# Altium schematic sheet AduCM3555.SchDoc: ADUCM355
size A4; DrawnBy: Lohith DAYANTRI; SheetNumber: 1; SheetTotal: 1
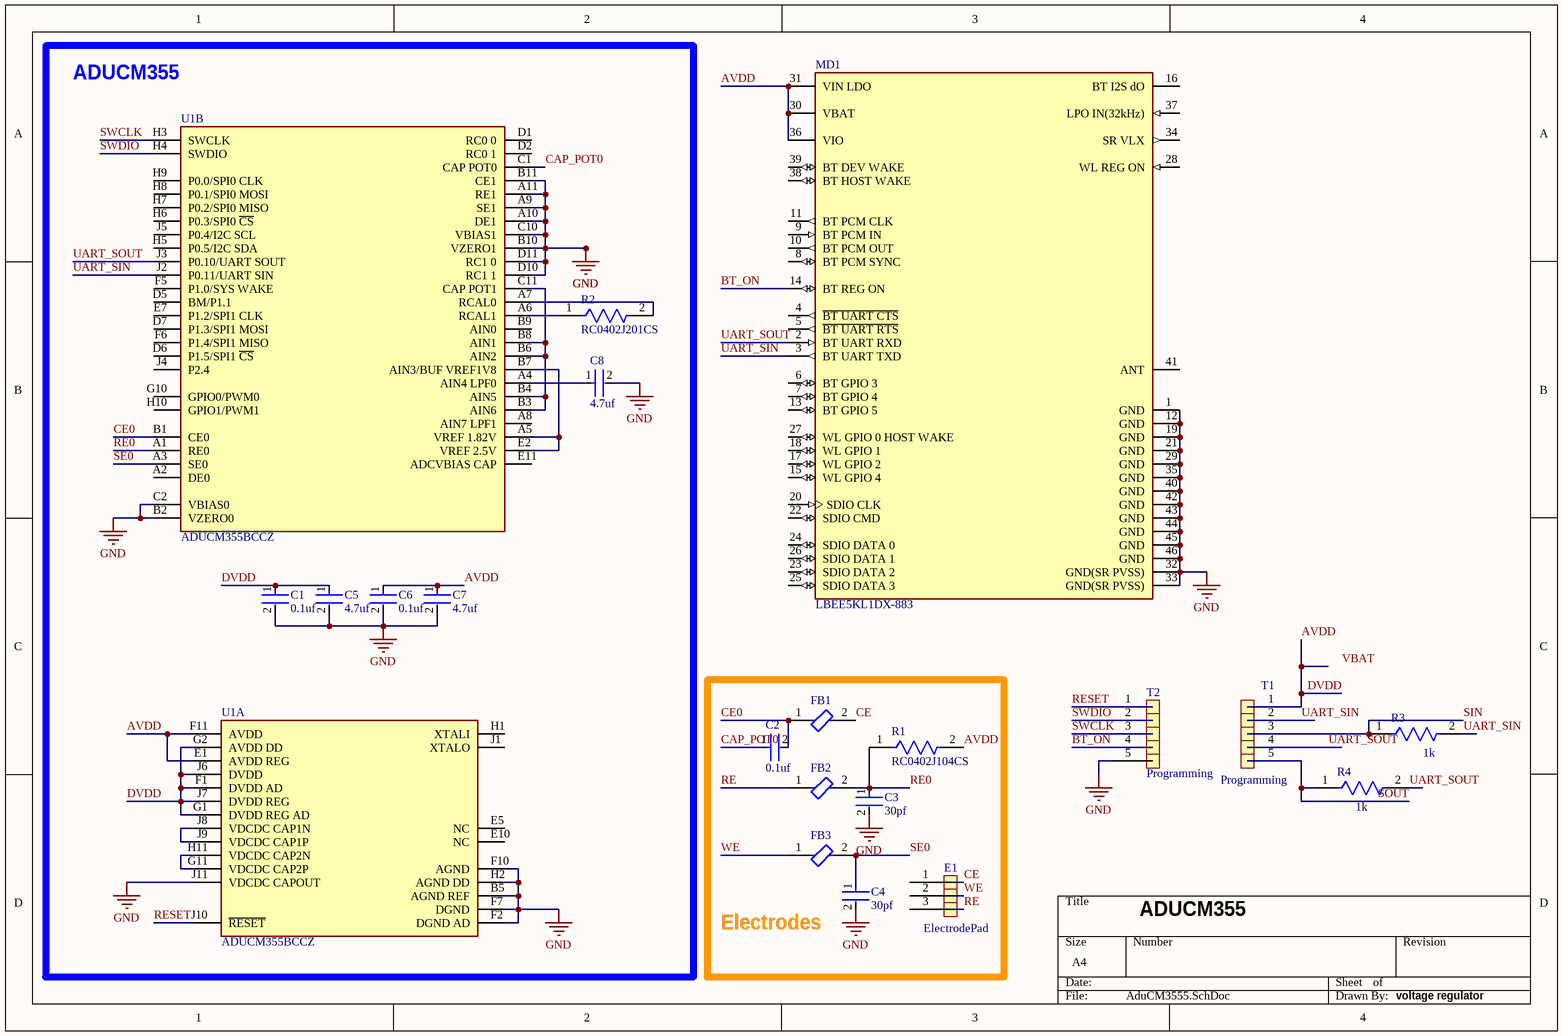
[diagram p0: AduCM3555.SchDoc]

## Parts
C1  0.1uf  [FP-GRM022-0_02-MFG]
C2  0.1uf  [FP-GRM022-0_02-MFG]
C3  30pf  [FP-GRM022-0_02-MFG]
C4  30pf  [FP-GRM022-0_02-MFG]
C5  4.7uf  [FP-GRM155-0_1-MFG]
C6  0.1uf  [FP-GRM022-0_02-MFG]
C7  4.7uf  [FP-GRM155-0_1-MFG]
C8  4.7uf  [FP-GRM155-0_1-MFG]
E1  ElectrodePad  [pad]
FB1  BLM15AG601SN1D  [FP-BLM15-0_05-MFG]  (value not drawn)
FB2  BLM15AG601SN1D  [FP-BLM15-0_05-MFG]  (value not drawn)
FB3  BLM15AG601SN1D  [FP-BLM15-0_05-MFG]  (value not drawn)
MD1  LBEE5KL1DX-883  [FP-LBEE5KL1DX-883-MFG]
R1  RC0402J104CS  [FP-RC0402-MFG]
R2  RC0402J201CS  [FP-RC0402-IPC_A]
R3  1k  [FP-RC0402-MFG]
R4  1k  [FP-RC0402-MFG]
T1  Programming  [Programming]
T2  Programming  [Programming]
U1  ADUCM355BCCZ  [FP-CC-72-2-MFG]  (parts A,B of 2)

## Blocks framed on the sheet
ADUCM355: C1 C5-C8 R2 U1
Electrodes: C2-C4 E1 FB1-FB3 R1

## Nets
GND: C1.2 C3.2 C4.2 C5.2 C6.2 C7.2 C8.2 MD1.1(GND) MD1.12(GND) MD1.19(GND) MD1.21(GND) MD1.29(GND) MD1.32(GND(SR_PVSS)) MD1.33(GND(SR_PVSS)) MD1.35(GND) MD1.40(GND) MD1.42(GND) MD1.43(GND) MD1.44(GND) MD1.45(GND) MD1.46(GND) U1.A9(SE1) U1.A10(DE1) U1.A11(RE1) U1.B2(VZERO0) U1.B5(AGND_REF) U1.B10(VZERO1) U1.B11(CE1) U1.C2(VBIAS0) U1.C10(VBIAS1) U1.D10(RC1_1) U1.D11(RC1_0) U1.F2(DGND_AD) U1.F7(DGND) U1.F10(AGND) U1.H2(AGND_DD) U1.J11(VDCDC_CAPOUT)
AVDD: C1.1 C5.1 C6.1 C7.1 MD1.30(VBAT) MD1.31(VIN_LDO) MD1.36(VIO) R1.2 T1.1 U1.E1(AVDD_REG) U1.F1(DVDD_AD) U1.F11(AVDD) U1.G1(DVDD_REG_AD) U1.G2(AVDD_DD) U1.J6(DVDD) U1.J7(DVDD_REG)  [also labelled DVDD]
BT_ON: MD1.14(BT_REG_ON) T2.4
CAP_POT0: C2.1 U1.C1(CAP_POT0)
CE: E1.1 FB1.2
CE0: C2.2 FB1.1 U1.B1(CE0)
RE: E1.3 FB2.1
RE0: C3.1 FB2.2 R1.1 U1.A1(RE0)
RESET: T2.1 U1.J10(~{RESET})
SE0: C4.1 FB3.2 U1.A3(SE0)
SIN: R3.1 T1.3
SOUT: R4.1 T1.5
SWCLK: T2.3 U1.H3(SWCLK)
SWDIO: T2.2 U1.H4(SWDIO)
UART_SIN: MD1.3(BT_UART_TXD) R3.2 T1.2 U1.J2(P0.11/UART_SIN)
UART_SOUT: MD1.2(BT_UART_RXD) R4.2 T1.4 U1.J3(P0.10/UART_SOUT)
WE: E1.2 FB3.1
NetC8_1: C8.1 U1.A4(AIN4_LPF0)
NetR2_1: R2.1 U1.A6(RCAL1)
NetR2_2: R2.2 U1.A7(RCAL0)
NetU1_A5: U1.A5(VREF_1.82V) U1.B7(AIN3/BUF_VREF1V8) U1.E2(VREF_2.5V)
NetU1_B3: U1.B3(AIN6) U1.B4(AIN5) U1.B6(AIN2) U1.B8(AIN1) U1.C11(CAP_POT1)
NetU1_G11: U1.G11(VDCDC_CAP2P) U1.H11(VDCDC_CAP2N)
NetU1_J8: U1.J8(VDCDC_CAP1N) U1.J9(VDCDC_CAP1P)

Not connected (* = marked no-connect by the designer): MD1 4(~{BT_UART_CTS}) 5(~{BT_UART_RTS}) 6(BT_GPIO_3) 7(BT_GPIO_4) 8(BT_PCM_SYNC) 9(BT_PCM_IN) 10(BT_PCM_OUT) 11(BT_PCM_CLK) 13(BT_GPIO_5) 15(WL_GPIO_4) 16(BT_I2S_dO) 17(WL_GPIO_2) 18(WL_GPIO_1) 20(SDIO_CLK) 22(SDIO_CMD) 23(SDIO_DATA_2) 24(SDIO_DATA_0) 25(SDIO_DATA_3) 26(SDIO_DATA_1) 27(WL_GPIO_0_HOST_WAKE) 28(WL_REG_ON) 34(SR_VLX) 37(LPO_IN(32kHz)) 38(BT_HOST_WAKE) 39(BT_DEV_WAKE) 41(ANT); T2 5; U1 A2(DE0) A8(AIN7_LPF1) B9(AIN0) D1(RC0_0) D2(RC0_1) D5(BM/P1.1) D6(P1.5/SPI1_~{CS}) D7(P1.3/SPI1_MOSI) E5(NC) E7(P1.2/SPI1_CLK) E10(NC) E11(ADCVBIAS_CAP) F5(P1.0/SYS_WAKE) F6(P1.4/SPI1_MISO) G10(GPIO0/PWM0) H1(XTALI) H5(P0.5/I2C_SDA) H6(P0.3/SPI0_~{CS}) H7(P0.2/SPI0_MISO) H8(P0.1/SPI0_MOSI) H9(P0.0/SPI0_CLK) H10(GPIO1/PWM1) J1(XTALO) J4(P2.4) J5(P0.4/I2C_SCL)

## Notes on the sheet
- voltage regulator
- Labels drawn without touching a wire or pin: VBAT

## Library data of the parts
C1 C2 C6 = CMP-06035-048848-1: Chip Multilayer Ceramic Capacitors for General Purpose, 01005, 0.10uF, X5R, 15%, 20%, 6.3V; Capacitance: 100nF; Packaging: Tape and Reel; Termination: SMD/SMT; Tolerance: 20%; Width: 0.2mm; Voltage Rating: 6.3V; Thickness: 0.009inch; Min Operating Temperature: -55°C; Length: 0.016inch; Dielectric: X5R; Lead Free: Lead Free; Max Operating Temperature: 85°C; Mount: Surface Mount; Case/Package: 0402; Voltage Rating (DC): 6.3V; Case Code (Imperial): 1005; Case Code (Metric): 1005; Height: 0.2mm; Weight: 0.000212oz; Package Quantity: 40000; Lead Pitch: 0.232inch
C3 C4 = CMP-06035-005973-1: Chip Multilayer Ceramic Capacitors for General Purpose, 01005, 30pF, C0G, 30ppm/°C, 5%, 50V; Capacitance: 30pF; Length: 400um; Dielectric: C0G; Voltage Rating (DC): 50V; Width: 200um; Thickness: 200um; Tolerance: 5%
C5 C7 C8 = CMP-2008-04549-2: Chip Multilayer Ceramic Capacitors for General Purpose, 0402, 4.7uF, X5R, 15%, 20%, 6.3V; Height: 0.5mm; Weight: 0.000212oz; Length: 1mm; Case Code (Metric): 1005; Packaging: Tape and Reel; Termination: SMD/SMT; Dielectric: X5R; Depth: 0.5mm; Case Code (Imperial): 0402; Min Operating Temperature: -55°C; Case/Package: 0402; Voltage: 6.3V; Width: 0.02inch; Capacitance: 4.7uF; Lead Free: Lead Free; Thickness: 0.022inch; Contact Plating: Tin; REACH SVHC: No SVHC; Package Quantity: 10000; Tolerance: 20%; Voltage Rating (DC): 6.3V; Voltage Rating: 6.3V; Mount: Surface Mount; Max Operating Temperature: 85°C
E1 = ElectrodePad: Rule: UNIONINDEX=0|RULEKIND=FabricationTestpoint|NETSCOPE=AnyNet|LAYERKIND=SameLayer|NAME=Schematic Fabrication Testpoint Style|SIDE=2|TESTPOINTUNDERCOMPONENT=TRUE|MINSIZE=40mil|MAXSIZE=100mil|PREFEREDSIZE=60mil|MINHOLESIZE=0mil|MAXHOLESIZE=40mil|PREFEREDHOLESIZE=32mil|TESTPOINTGRID=1mil|ALLOWSIDEBOTTOM=TRUE|USEGRID=TRUE|GRIDTOLERANCE=0.01mil|UNIT=Imperial
FB1-FB3 = CMP-0686-00187-4: Chip Ferrite Bead, 0402, 600Ω @ 100MHz, 0.52Ω, 25%, 300mA; DC Resistance-Max: 600mR; Number of Lines: 1; DC Resistance (DCR): 520mR; Shielding: Unshielded; Impedance: 600R; Material: Steel; Frequency: 100MHz; Lead Free: Lead Free; Max DC Current: 300mA; Test Frequency: 100MHz; Depth: 0.55mm; Length: 1mm; Case Code (Imperial): 0402; Packaging: Tape and Reel; Height: 0.5mm; Max Operating Temperature: 125°C; Military Standard: Not; REACH SVHC: No SVHC; Case Code (Metric): 1005; Series: BLM15AG_SN; Core Material: Ferrite; Termination: SMD/SMT; DC Current: 300mA; Package Quantity: 10000; Width: 0.5mm; RoHS Compliant: Yes; Min Operating Temperature: -55°C; Current Rating: 300mA; Case/Package: 0402; Number of Pins: 2; Radiation Hardening: No; Tolerance: 25%; Number of Circuits: 1; Max Current Rating: 300mA
MD1 = CMP-06130-000006-1: RF TXRX MOD BLUETOOTH/WIFI; Manufacturer: Murata; Receiving Current: 47mA; Sensitivity: -91dBm; Max Supply Voltage: 4.8V; Nominal Supply Current: 25-28mA; Data Rate: 65Mbits/s; Bandwidth: 1MHz; Transmitting Current: 260-320mA; Min Supply Voltage: 1.71V; Max Frequency: 2483.5MHz; Interface: UART,Other; Package: 0; Temperature Range High: +70°C; Device Class L2: RF Semiconductors and Devices; Automotive: No; Manufacturer Part Number: LBEE5KL1DX-883; Category: UNK; Temperature: -30°C to +70°C; ComponentLink2Description: Datasheet; Temperature Range Low: -30°C; Octopart: https://octopart.com/lbee5kl1dx-883-murata-74182126; Device Class L3: Transceivers; Lead Free: Yes; ComponentLink2URL: https://content.arduino.cc/assets/Arduino-Portenta-H7_Datasheet_Murata-1dx.pdf; RoHS: TRUE; Device Class L1: Integrated Circuits (ICs); Digikey Description: RF TXRX MOD BLUETOOTH/WIFI; Height: 1.1mm
R1 = CMP-13261-004860-1: Res Thick Film 01005 100kΩ 5% 0.03W ±250ppm/°C Molded SMD T/R; Resistance: 100kR; Voltage Rating (DC): 15V; Max Power Dissipation: 30mW; Temperature Coefficient: 250ppm/°C; Max Operating Temperature: 125°C; Tolerance: 5%; Length: 0.016inch; Features: Moisture Resistant; Case Code (Metric): 0402; Composition: Thick Film; Packaging: Tape and Reel; Number of Terminations: 2; Case Code (Imperial): 1005; Lead Free: Lead Free; Min Operating Temperature: -55°C; Package Quantity: 1; Height: 0.006inch; Width: 0.008inch
R2 = CMP-13261-004485-1: Res Thick Film 01005 200Ω 5% 0.03W ±250ppm/°C Molded SMD T/R; Max Power Dissipation: 30mW; Resistance: 200R; Voltage Rating (DC): 15V; Temperature Coefficient: 250ppm/°C; Tolerance: 5%; Features: Moisture Resistant; Min Operating Temperature: -55°C; Case Code (Imperial): 1005; Case Code (Metric): 0402; Composition: Thick Film; Width: 0.008inch; Lead Free: Lead Free; Height: 0.006inch; Number of Terminations: 2; Package Quantity: 1; Max Operating Temperature: 125°C; Length: 0.016inch; Packaging: Cut Tape
R3 R4 = CMP-13261-002020-1: Res Thick Film 01005 1kΩ 5% 0.03W ±250ppm/°C Molded SMD T/R; Resistance: 1kR; Voltage Rating (DC): 15V; Max Power Dissipation: 30mW; Features: Moisture Resistant; Number of Terminations: 2; Case Code (Metric): 0402; Min Operating Temperature: -55°C; Tolerance: 5%; Max Operating Temperature: 125°C; Lead Free: Lead Free; Package Quantity: 1; Length: 0.016inch; Packaging: Cut Tape; Temperature Coefficient: 250ppm/°C; Height: 0.006inch; Case Code (Imperial): 1005; Width: 0.008inch; Composition: Thick Film
T1 T2 = Programming: Rule: UNIONINDEX=0|RULEKIND=FabricationTestpoint|NETSCOPE=AnyNet|LAYERKIND=SameLayer|NAME=Schematic Fabrication Testpoint Style|SIDE=2|TESTPOINTUNDERCOMPONENT=TRUE|MINSIZE=40mil|MAXSIZE=100mil|PREFEREDSIZE=60mil|MINHOLESIZE=0mil|MAXHOLESIZE=40mil|PREFEREDHOLESIZE=32mil|TESTPOINTGRID=1mil|ALLOWSIDEBOTTOM=TRUE|USEGRID=TRUE|GRIDTOLERANCE=0.01mil|UNIT=Imperial
U1 = CMP-09090-000013-1: IC MCU 32BIT 128KB FLASH 72LGA; Number of Pins: 72; RoHS Compliant: Yes